# EAGLE schematic Booster (EAGLE 9.6.2)
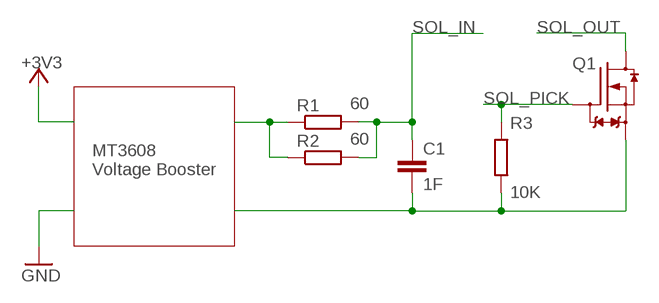
[diagram p0: schematic, sheet 1]

## Parts
C1  1F  CAP_0603  [0603]
Q1  SI1308EDL  [SOT-323]
R1  60  RES_0603  [0603]
R2  60  RES_0603  [0603]
R3  10K  RES_0603  [0603]

## Nets
N$1: R1.1 R2.1
N$2: C1.2 Q1.2(S) R3.1
SOL_IN: C1.1 R1.2 R2.2
SOL_OUT: Q1.3(D)
SOL_PICK: Q1.1(G) R3.2

## Notes on the sheet
- MT3608
  Voltage Booster

## Library data of the parts
C1 = ZHAW_BA:CAP_0603: Cap, 0603, Keramik, X7R, +-10%
Q1 = ZHAW_BA:SI1308EDL: MOSFET N-CH 30V 1.4A SOT323 Distrelec: DigiKey: Pt.Nr: SI1308EDL-T1-GE3CT-ND https://www.digikey.ch/products/de/discrete-semiconductor-products/transistors-fets-mosfets-single/278?k=SI1308EDL&k=&pkeyword=SI1308EDL&sv=0&pv1291=405475&sf=0&FV=-8%7C278%2C7%7C2&quantity=&ColumnSort=0&page=1&pageSize=25
R1-R3 = ZHAW_BA:RES_0603: Resistor, 0603, 0.1 W, +-1%